# Altium schematic sheet 3V3低压模块.SchDoc: 3V3低压模块
size A4; Author: GAOYANG; Organization: Altium Limited; Address1: L3, 12a Rodborough Rd; Address2: Frenchs Forest; Address3: NSW; Address4: Australia 2086
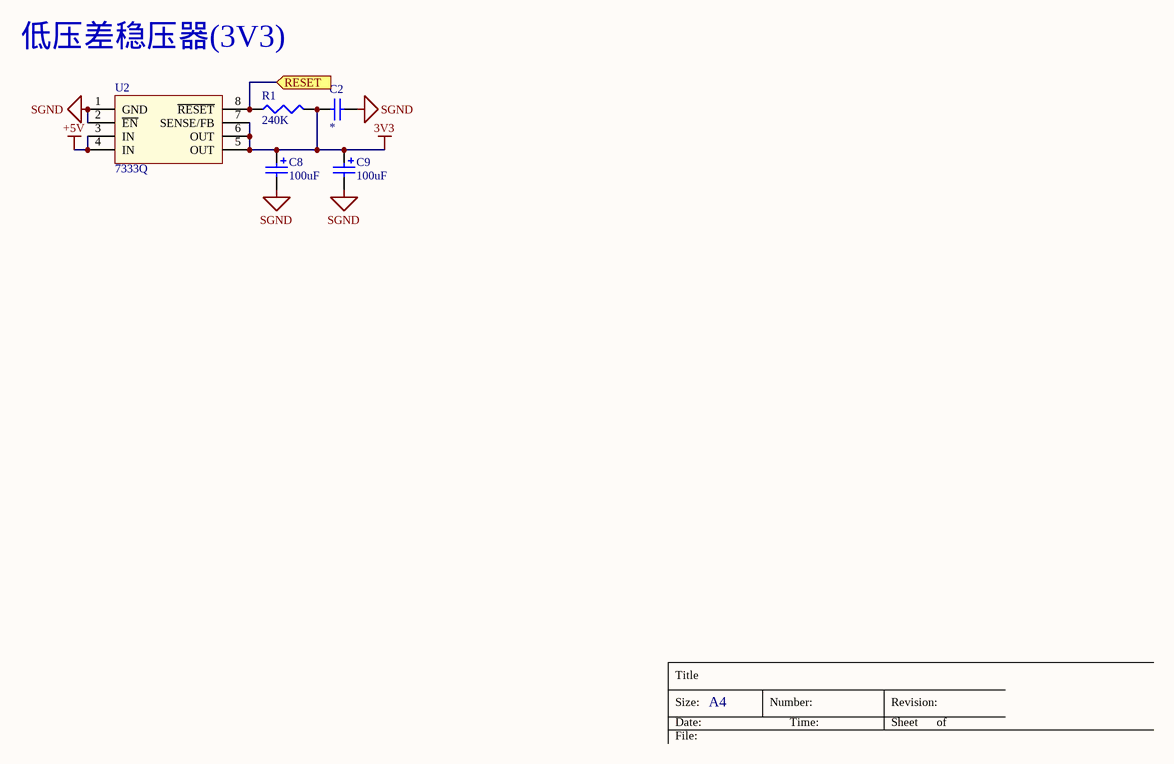
[diagram p0: 3V3低压模块.SchDoc]

## Parts
C2  Cap  [0603-L]  (value not drawn)
C8  value 100uF  [CAP1+]  (hidden comment: Cap Pol2)
C9  value 100uF  [CAP1+]  (hidden comment: Cap Pol2)
R1  value 240K  [0805]  (hidden comment: Res3)
U2  7333Q  [TJA10]

## Ports
RESET (in)

## Nets
3V3: C2.2 C8.1 C9.1 R1.2 U2.5(OUT) U2.6(OUT) U2.7(SENSE/FB)
+5V: U2.3(IN) U2.4(IN)
SGND: C2.1 C8.2 C9.2 U2.1(GND) U2.2(~{EN})
RESET: R1.1 U2.8(~{RESET}) ; port RESET

## Notes on the sheet
- 低压差稳压器(3V3)
- Title
- Size:
- Date:
- A4
- Number:
- Time:
- Revision:
- Sheet
- of
- File:

## Library data of the parts
C2 = Cap: Capacitor; Published: 8-Jun-2000; LatestRevisionDate: 17-Jul-2002; LatestRevisionNote: Re-released for DXP Platform.; PackageReference: RAD-0.3; Publisher: Altium Limited; PackageDescription: Radial Cap, Thru-Hole; 2 Leads; 0.3 in Pin Spacing; Value: *
C8 C9 = Cap Pol2: Polarized Capacitor (Axial); Published: 8-Jun-2000; LatestRevisionDate: 17-Jul-2002; LatestRevisionNote: Re-released for DXP Platform.; PackageReference: POLAR0.8; Publisher: Altium Limited; PackageDescription: Polarized Capacitor; 2 Leads
R1 = Res3: Resistor; Published: 8-Jun-2000; LatestRevisionDate: 29-May-2009; LatestRevisionNote: IPC-7351 Footprint Added.; PackageReference: J1-0603; Publisher: Altium Limited; PackageDescription: Chip Resistor
U2 = 7333Q: 3.3V Output voltage